# EasyEDA Pro project 搞机小队_v1.1.3.eprj, board 主控
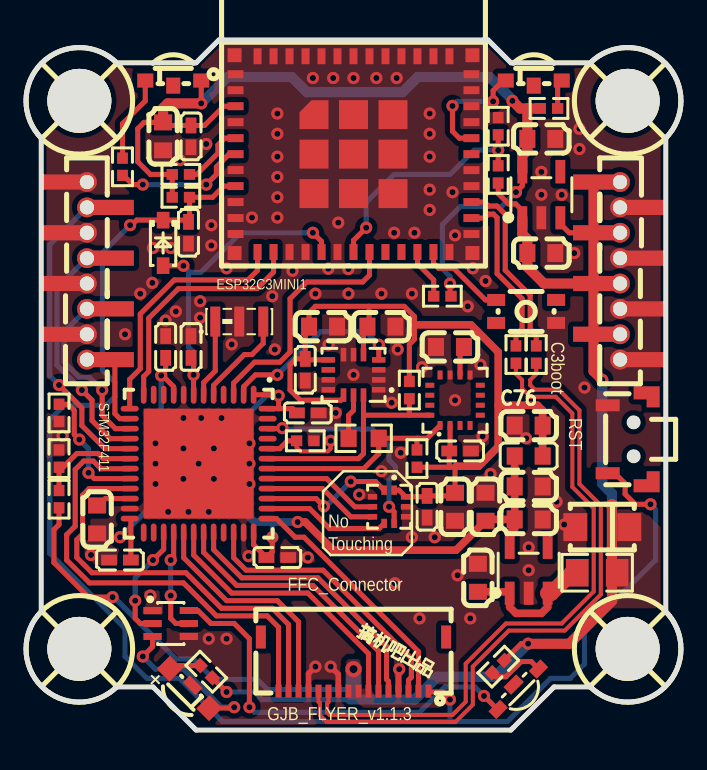
[diagram p2: board, top side]
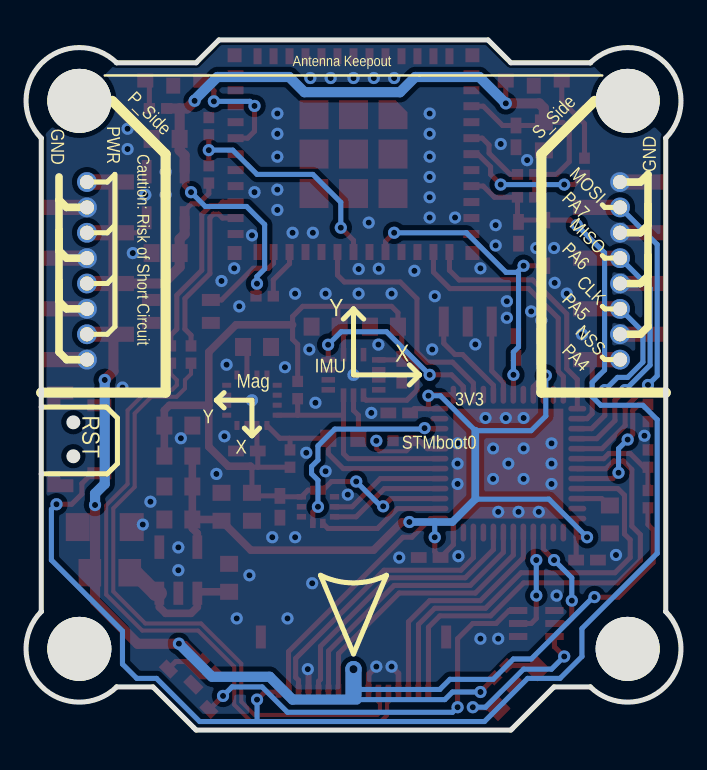
[diagram p3: board, bottom side, seen from below]

Outline 32.77 x 34.54 mm; copper layers: Top Layer, Bottom Layer. Coordinates in mm from the lower left corner of the outline.
Outline path: 4.53,33.41 arc(0.79,33.38) 0.76,29.64 0.77,29.63 0.77,5.93 0.76,5.92 arc(0.79,2.18) 4.53,2.15 4.54,2.16 6.35,2.16 8.51,0 24.26,0 26.42,2.16 28.24,2.16 28.24,2.15 arc(31.99,2.18) 32.01,5.92 32.01,5.93 32.01,29.63 32.01,29.64 arc(31.99,33.38) 28.24,33.41 28.24,33.4 24.26,33.4 23.12,34.54 9.66,34.54 8.51,33.4 4.54,33.4 ; 4.53,33.41 4.54,33.4 ; 4.53,33.41 4.54,33.4
Stack: Top Layer 0.035mm / Dielectric1 1.51mm FR4 er 4.5 / Bottom Layer 0.035mm

## Design rules (mm)
net $1N52615: DP5
net $1N52617: DP5
net UD3_N: DP4
net UD3_P: DP4
template: 自定义配置
spacing copperThickness1oz (default): track to track 0.102, other pairs 0.152 to 0.3
spacing copperThickness2oz: track to track 0.203, other pairs 0.152 to 0.3
track width copperThickness1oz (default): min 0.127, default 0.254, max 2.54
track width copperThickness2oz: min 0.203, default 0.254, max 2.54
differential pair differentialPair (default): width min 0.127, default 0.254, max 2.54; gap min 0.152, default 0.152
via viaSize (default): diameter min 0.5, default 0.61, max 10; hole min 0.3, default 0.305, max 6.3

## Placement (name value [footprint] x y rotation side)
C3  10uF  [C0603]  25.79 23.88 180 top
C4  1uF  [C0603]  25.79 29.59 180 top
C6  1uF  [C0603]  25.15 10.54 180 top
C7  1uF  [C0603]  22.61 7.62 270 top
C8  10uF  [C0603]  25.15 12.19 180 top
C27  10uF  [C0603]  3.56 10.54 90 top
C31  10uF  [C0603]  22.99 11.18 270 top
C41  10uF  [C0603]  6.86 29.72 270 top
C51  4.7uF  [C0603]  21.47 11.18 270 top
C52  4.7uF  [C0603]  21.21 19.18 180 top
C55  2.2uF  [C0603]  14.86 20.19 180 top
C56  10nF  [C0603]  17.78 20.19 180 top
C65  100nF  [C0402]  4.7 8.51 0 top
C66  100nF  [C0402]  12.58 8.64 180 top
C67  100nF  [C0402]  14.1 15.88 180 top
C68  100nF  [C0402]  6.99 19.18 270 top
C69  100nF  [C0402]  8.26 19.18 270 top
C70  100nF  [C0402]  13.97 18.03 90 top
C71  100nF  [C0402]  21.72 13.97 180 top
C72  100nF  [C0402]  20.07 11.18 90 top
C73  100nF  [C0402]  8.13 24.89 90 top
C74  100nF  [C0402]  8.26 29.72 270 top
C75  47uF  [CAP-SMD_L3.2-W1.6]  28.83 10.16 180 top
C76  10uF  [C0603]  25.15 15.24 0 top
D4  BAT54WS  [SOD-323_L1.7-W1.3-LS2.6-RD]  6.86 24.38 270 top
FPC2  AFC05-S16FIA-00  [FPC-SMD_16P-P0.50_AFC05-S16FIA-00]  16.39 3.3 180 top
LED2  XL-3210SURC  [LED-SMD_3P-L3.2-W1.5-RD_EH-S110KGKT]  24.52 2.16 225 top
LED3  XL-3210UWC  [LED-SMD_3P-L3.2-W1.5-RD_ORANGE]  7.37 32.38 0 top
LED4  XL-3210UWC  [LED-SMD_3P-L3.2-W1.5-RD_ORANGE]  25.4 32.38 0 top
NOREF  -  [Pad_e1243]  3.05 24.89 0 top
NOREF#2  -  [Pad_e1242]  3.05 26.16 0 top
NOREF#3  -  [Pad_e1265]  29.72 24.89 0 top
NOREF#4  -  [Pad_e1247]  3.05 19.81 0 top
NOREF#5  -  [Pad_e1246]  3.05 21.08 0 top
NOREF#6  -  [Pad_e1264]  29.72 26.16 0 top
NOREF#7  -  [Pad_e1241]  3.05 27.43 0 top
NOREF#8  -  [Pad_e1267]  29.72 22.35 0 top
NOREF#9  -  [Pad_e1266]  29.72 23.62 0 top
NOREF#10  -  [Pad_e1248]  3.05 18.54 0 top
NOREF#11  -  [Pad_e1269]  29.72 19.81 0 top
NOREF#12  -  [Pad_e1244]  3.05 23.62 0 top
NOREF#13  -  [Pad_e1268]  29.72 21.08 0 top
NOREF#14  -  [Pad_e1270]  29.72 18.54 0 top
NOREF#15  -  [Pad_e1245]  3.05 22.35 0 top
NOREF#16  -  [Pad_e1263]  29.72 27.43 0 top
Q7  BSS138PS  [SOT-363_L2.1-W1.3-P0.65-LS2.3-BL]  7.24 5.33 270 top
R2  0Ω  [R0805]  28.58 7.87 180 top
R51  0Ω  [R0402]  24.52 18.8 90 top
R52  0Ω  [R0402]  25.53 18.8 90 top
R53  10kΩ  [R0402]  7.75 27.81 0 top
R54  10kΩ  [R0402]  20.83 21.72 180 top
R55  10kΩ  [R0402]  7.75 26.67 180 top
R56  10kΩ  [R0402]  1.66 15.88 270 top
R57  10kΩ  [R0402]  13.97 14.48 180 top
R71  10kΩ  [R0402]  1.66 11.56 270 top
R72  10kΩ  [R0402]  1.66 13.59 270 top
R73  10kΩ  [R0402]  23.63 27.81 270 top
R74  10kΩ  [R0402]  23.63 30.23 270 top
R80  4.7kΩ  [R0402]  19.18 17.02 270 top
R81  4.7kΩ  [R0402]  19.56 13.59 90 top
R100  10kΩ  [R0402]  9.02 2.92 315 top
R101  10kΩ  [R0402]  23.63 3.17 45 top
R102  10kΩ  [R0402]  4.83 28.19 90 top
R103  10kΩ  [R0402]  26.17 31.11 180 top
R104  0Ω  [R0603]  16.9 14.6 0 top
SCREW5  -  [M3螺丝]  2.67 31.5 0 top
SCREW6  -  [M3螺丝]  2.67 4.06 0 top
SCREW7  -  [M3螺丝]  30.1 31.5 0 top
SCREW8  -  [M3螺丝]  30.1 4.06 0 top
SW3  TS24CA  [SW-SMD_2P-TS24CA]  30.08 14.55 270 top
SW4  1TS028A-1800-0600-CT  [SW-SMD_4P-L2.8-W1.9-P1.20-LS3.0_1TS028A]  25.02 20.95 0 top
U2  XC6204B302MR  [SOT-23-5_L3.0-W1.7-P0.95-LS2.8-BL]  25.79 26.8 0 top
U3  XC6204B302MR  [SOT-23-5_L3.0-W1.7-P0.95-LS2.8-BL]  25.15 8 0 top
U9  STM32F411CEU6  [UFQFPN-48_L7.0-W7.0-P0.50-BL-EP]  8.64 13.33 180 top
U10  2.4GHz  [WIFIM-SMD_ESP32-C3-MINI-1]  16.39 28.83 0 top
U15  LPS22HBTR  [HLGA-10L_LPS22HBTR]  18.17 11.18 270 top
U16  QMC5883P  [LGA-16_L3.0-W3.0-P0.50-BL_SQ]  21.47 16.51 0 top
U17  ICM-42688-P  [LGA-14_L3.0-W2.5-P0.50-TL]  16.39 17.78 180 top
U20  XL-3210UGC  [LED-SMD_3P-L3.2-W1.5-RD_GREEN]  8.26 2.16 135 top
U21  IPCP127F08PB08S  [HDR-SMD_IPCP127F08PB08S]  3.05 22.99 270 top
U22  IPCP127F08PB08S  [HDR-SMD_IPCP127F08PB08S]  29.72 22.99 90 top
U23  MPH160809S100MT  [L0603]  25.15 13.72 0 top
X2  8MHz  [OSC-SMD_3P-L3.2-W1.3-P1.20]  10.67 20.45 0 top

## Footprints (pads in the part's own frame, mm; a bottom-side part is the same pattern mirrored in y, then rotated)
C0402
  rect 0.79x0.54 smd: 1(-0.545,0) 2(0.545,0)
C0603
  rect 0.8x0.9 smd: 1(-0.7,0) 2(0.7,0)
CAP-SMD_L3.2-W1.6
  rect 1.2x1.4 smd: 1(-1.35,0) 2(1.35,0)
FPC-SMD_16P-P0.50_AFC05-S16FIA-00
  rect 0.3x0.65 smd: 1(-3.75,1.355) 2(-3.25,1.355) 3(-2.75,1.355) 4(-2.25,1.355) 5(-1.75,1.355) 6(-1.25,1.355) 7(-0.75,1.355) 8(-0.25,1.355) 9(0.25,1.355) 10(0.75,1.355) 11(1.25,1.355) 12(1.75,1.355) 13(2.25,1.355) 14(2.75,1.355) 15(3.25,1.355) 16(3.75,1.355)
  rect 0.5x1.15 smd: 17(4.635,-1.355) 18(-4.635,-1.355)
HDR-SMD_IPCP127F08PB08S
  rect 0.76x2.05 smd: 1(-4.445,-1.325) 2(-3.175,1.325) 3(-1.905,-1.325) 4(-0.635,1.325) 5(0.635,-1.325) 6(1.905,1.325) 7(3.175,-1.325) 8(4.445,1.325)
HLGA-10L_LPS22HBTR
  rect 0.465x0.28 smd: 1(-0.833,0.255) 2(-0.833,-0.245) 6(0.833,-0.245) 7(0.833,0.255)
  rect 0.28x0.465 smd: 3(-0.5,-0.828) 4(0,-0.828) 5(0.5,-0.828) 8(0.5,0.828) 9(0,0.828) 10(-0.5,0.828)
L0603
  rect 0.8x0.864 smd: 1(-0.7,0) 2(0.7,0)
LED-SMD_3P-L3.2-W1.5-RD_EH-S110KGKT
  rect 0.82x0.55 smd: 1(1.43,0.165) 2(-1.43,0.165)
  rect 0.9x0.54 smd: 3(0,-0.165)
LED-SMD_3P-L3.2-W1.5-RD_GREEN
  rect 0.9x0.93 smd: 1(-1.4,0.11) 2(1.4,0.11)
  rect 0.9x0.49 smd: 3(0,-0.11)
LED-SMD_3P-L3.2-W1.5-RD_ORANGE
  rect 0.8x0.7 smd: 1(-1.4,0.127) 2(1.4,0.127)
  rect 0.7x0.8 smd: 3(0,-0.127)
LGA-14_L3.0-W2.5-P0.50-TL
  rect 0.675x0.28 smd: 1(-1.262,0.75) 2(-1.262,0.25) 3(-1.262,-0.25) 4(-1.262,-0.75) 8(1.262,-0.75) 9(1.262,-0.25) 10(1.262,0.25) 11(1.262,0.75)
  rect 0.28x0.675 smd: 5(-0.5,-1.012) 6(0,-1.012) 7(0.5,-1.012) 12(0.5,1.012) 13(0,1.012) 14(-0.5,1.012)
LGA-16_L3.0-W3.0-P0.50-BL_SQ
  rect 0.25x0.45 smd: 1(-0.75,-1.263) 2(-0.25,-1.263) 3(0.25,-1.263) 4(0.75,-1.263) 9(0.75,1.263) 10(0.25,1.263) 11(-0.25,1.263) 12(-0.75,1.263)
  rect 0.45x0.25 smd: 5(1.263,-0.75) 6(1.263,-0.25) 7(1.263,0.25) 8(1.263,0.75) 13(-1.263,0.75) 14(-1.263,0.25) 15(-1.263,-0.25) 16(-1.263,-0.75)
M3螺丝
  round 3.2 hole 3.2: 1(0,0)
OSC-SMD_3P-L3.2-W1.3-P1.20
  rect 0.5x1.5 smd: 1(-1.2,0) 2(0,0) 3(1.2,0)
Pad_e1241
  round 0.991 hole 0.711: 1(0,0)
Pad_e1242
  round 0.991 hole 0.711: 2(0,0)
Pad_e1243
  round 0.991 hole 0.711: 3(0,0)
Pad_e1244
  round 0.991 hole 0.711: 4(0,0)
Pad_e1245
  round 0.991 hole 0.711: 5(0,0)
Pad_e1246
  round 0.991 hole 0.711: 6(0,0)
Pad_e1247
  round 0.991 hole 0.711: 7(0,0)
Pad_e1248
  round 0.991 hole 0.711: 8(0,0)
Pad_e1263
  round 0.991 hole 0.711: 1(0,0)
Pad_e1264
  round 0.991 hole 0.711: 2(0,0)
Pad_e1265
  round 0.991 hole 0.711: 3(0,0)
Pad_e1266
  round 0.991 hole 0.711: 4(0,0)
Pad_e1267
  round 0.991 hole 0.711: 5(0,0)
Pad_e1268
  round 0.991 hole 0.711: 6(0,0)
Pad_e1269
  round 0.991 hole 0.711: 7(0,0)
Pad_e1270
  round 0.991 hole 0.711: 8(0,0)
R0402
  rect 0.566x0.54 smd: 1(-0.433,0) 2(0.433,0)
R0603
  rect 0.806x0.864 smd: 1(-0.753,0) 2(0.753,0)
R0805
  rect 1.133x1.377 smd: 1(-1,0) 2(1,0)
SOD-323_L1.7-W1.3-LS2.6-RD
  rect 0.83x0.63 smd: 1(-1.14,0) 2(1.14,0)
SOT-23-5_L3.0-W1.7-P0.95-LS2.8-BL
  rect 0.49x1.157 smd: 1(-0.95,-1.153) 2(0,-1.153) 3(0.95,-1.153)
  rect 0.49x1.175 smd: 4(0.95,1.153) 5(-0.95,1.153)
SOT-363_L2.1-W1.3-P0.65-LS2.3-BL
  rect 0.35x0.916 smd: 1(-0.65,-0.908) 2(0,-0.908) 3(0.65,-0.908) 4(0.65,0.908) 5(0,0.908) 6(-0.65,0.908)
SW-SMD_2P-TS24CA
  rect 0.6x1.2 smd: 1(-1.7,-0.975) 2(1.7,-0.975)
  custom 1.05x1.3 smd: 3(2.125,0.975) 4(-2.125,0.975)
SW-SMD_4P-L2.8-W1.9-P1.20-LS3.0_1TS028A
  rect 0.9x0.6 smd: 1(-1.5,0.575) 2(-1.5,-0.575) 3(1.5,0.575) 4(1.5,-0.575)
UFQFPN-48_L7.0-W7.0-P0.50-BL-EP
  oval 0.28x0.9 smd: 1(-2.751,-3.45) 2(-2.251,-3.45) 3(-1.75,-3.45) 4(-1.25,-3.45) 5(-0.749,-3.45) 6(-0.249,-3.45) 7(0.249,-3.45) 8(0.75,-3.45) 9(1.25,-3.45) 10(1.75,-3.45) 11(2.251,-3.45) 12(2.751,-3.45) 25(2.751,3.449) 26(2.251,3.449) 27(1.75,3.449) 28(1.25,3.449) 29(0.75,3.449) 30(0.249,3.449) 31(-0.249,3.449) 32(-0.749,3.449) 33(-1.25,3.449) 34(-1.75,3.449) 35(-2.251,3.449) 36(-2.751,3.449)
  oval 0.9x0.28 smd: 13(3.45,-2.751) 14(3.45,-2.251) 15(3.45,-1.75) 16(3.45,-1.25) 17(3.45,-0.75) 18(3.45,-0.249) 19(3.45,0.249) 20(3.45,0.749) 21(3.45,1.25) 22(3.45,1.75) 23(3.45,2.251) 24(3.45,2.751) 37(-3.449,2.751) 38(-3.449,2.251) 39(-3.449,1.75) 40(-3.449,1.25) 41(-3.449,0.749) 42(-3.449,0.249) 43(-3.449,-0.249) 44(-3.449,-0.75) 45(-3.449,-1.25) 46(-3.449,-1.75) 47(-3.449,-2.251) 48(-3.449,-2.751)
  rect 5.5x5.5 smd: 49(0,0)
WIFIM-SMD_ESP32-C3-MINI-1
  rect 0.8x0.4 smd: 1(-5.9,4) 2(-5.9,3.2) 3(-5.9,2.4) 4(-5.9,1.6) 5(-5.9,0.8) 6(-5.9,0) 7(-5.9,-0.8) 8(-5.9,-1.6) 9(-5.9,-2.4) 10(-5.9,-3.2) 11(-5.9,-4) 25(5.9,-4) 26(5.9,-3.2) 27(5.9,-2.4) 28(5.9,-1.6) 29(5.9,-0.8) 30(5.9,0) 31(5.9,0.8) 32(5.9,1.6) 33(5.9,2.4) 34(5.9,3.2) 35(5.9,4)
  rect 0.4x0.8 smd: 12(-4.8,-4.9) 13(-4,-4.9) 14(-3.2,-4.9) 15(-2.4,-4.9) 16(-1.6,-4.9) 17(-0.8,-4.9) 18(0,-4.9) 19(0.8,-4.9) 20(1.6,-4.9) 21(2.4,-4.9) 22(3.2,-4.9) 23(4,-4.9) 24(4.8,-4.9) 36(4.8,4.9) 37(4,4.9) 38(3.2,4.9) 39(2.4,4.9) 40(1.6,4.9) 41(0.8,4.9) 42(0,4.9) 43(-0.8,4.9) 44(-1.6,4.9) 45(-2.4,4.9) 46(-3.2,4.9) 47(-4,4.9) 48(-4.8,4.9)
  custom 1.45x1.45 smd: 49(-1.975,1.975)
  rect 1.45x1.45 smd: 49(-1.975,0) 49(-1.975,-1.975) 49(0,1.975) 49(0,0) 49(0,-1.975) 49(1.975,1.975) 49(1.975,0) 49(1.975,-1.975)
  rect 0.7x0.7 smd: 50(5.95,4.95) 51(5.95,-4.95) 52(-5.95,-4.95) 53(-5.95,4.95)

## Nets
As in the schematic, except:
GND: C3.1 C4.1 C6.1 C7.1 C8.1 C27.1 C31.1 C41.2 C51.2 C52.2 C55.1 C56.1 C65.1 C66.1 C67.1 C68.1 C69.1 C70.1 C71.1 C72.1 C73.1 C74.2 C75.2 C76.1 FPC2.4 FPC2.10 FPC2.13 NOREF.3 NOREF#4.7 NOREF#6.2 NOREF#7.1 NOREF#9.4 NOREF#13.6 NOREF#14.8 NOREF#15.5 Q7.1 Q7.4 R56.2 R57.1 R72.1 R74.1 SW3.1 SW4.4 U2.2 U3.2 U9.8 U9.23 U9.35 U9.47 U9.49 U10.1 U10.2 U10.4 U10.7 U10.9 U10.10 U10.11 U10.14 U10.15 U10.17 U10.24 U10.25 U10.28 U10.29 U10.32 U10.33 U10.34 U10.35 U10.36 U10.37 U10.38 U10.39 U10.40 U10.41 U10.42 U10.43 U10.44 U10.45 U10.46 U10.47 U10.48 U10.49 U10.50 U10.51 U10.52 U10.53 U15.3 U15.8 U15.9 U16.9 U16.11 U17.1 U17.2 U17.3 U17.6 U17.7 U17.10 U17.11 U21.1 U21.3 U21.5 U21.7 U22.1 U22.3 U22.5 U22.7 X2.2
POWER: C3.2 C75.1 FPC2.8 FPC2.9 NOREF#3.3 NOREF#8.5 NOREF#11.7 NOREF#16.1 R2.1 R71.2 R73.2 R100.2 R101.2 U2.1 U2.3 U22.2 U22.4 U22.6 U22.8
STM_SPI_CLK1: NOREF#5.6 U9.15 U21.6
STM_SPI_MISO1: NOREF#12.4 U9.16 U21.4
STM_SPI_MOSI1: NOREF#2.2 U9.17 U21.2
STM_SPI_NSS1: NOREF#10.8 U9.14 U21.8

Pads without a net: FPC2 17 18; LED2 3; LED3 3; LED4 3; SCREW5 1; SCREW6 1; SCREW7 1; SCREW8 1; SW3 3 4; SW4 2 3; U2 4; U3 4; U9 4 10 11 25 26 33 45; U10 20 21 30; U16 3 4 5 6 7 8 12 13 14 15; U17 9; U20 3

## Via types
v1: diameter 0.61, hole 0.305, Top Layer to Bottom Layer, 153 vias
v2: diameter 0.813, hole 0.406, Top Layer to Bottom Layer, 1 via

## Routing (per net, layer and track width the routed paths; a pad name or vN(x,y) marks a point on that pad's centre or on a via; arc(x,y) is an arc through that point)
3V3_D: length 51.1
  Top Layer w0.254: C67.2 13.35,16.09 12.64,16.09 ; 12.64,16.09 v1(12.64,16.73) 12.59,16.78 U9.1 ; 12.64,16.09 U9.48 ; U9.36 11.39,9.28 C66.2 12.32,8.93 v1(12.32,9.65) ; U9.24 5.25,10.53 5.25,9.65 ; U9.9 7.39,17.19 6.8,17.78 v1(6.77,17.75) 6.74,17.78 6.99,18.03 C68.2 ; 5.25,9.65 C65.2 ; 5.25,9.65 v1(4.7,9.65)
  Top Layer w0.381: U3.5 24.2,9.84 24.45,10.09 C6.2 ; C6.2 C8.2 U23.1 ; C6.2 23.06,10.54 C31.2 21.52,9 15.38,9 13.97,10.41 v1(13.59,10.41)
  Bottom Layer w0.254: 10.29,11.56 6.61,11.56 v1(4.7,9.65) ; v1(6.77,17.75) 6.77,15.72 7.5,14.99 10.29,14.99 12.04,16.73 v1(12.64,16.73) ; v1(12.32,9.65) 12.32,10.41
  Bottom Layer w0.381: 10.29,14.99 10.29,11.56 11.43,10.41 v1(13.59,10.41)
3V3_IMU: length 45.5
  Top Layer w0.254: U17.12 15.89,16.64 15.75,16.51 13.72,16.51 13.21,17.02 13.21,18.29 13.5,18.58 C70.2 ; 21.17,13.16 21.18,13.16 C71.2 21.22,14.01 U16.2 ; 21.17,13.16 R81.1 ; 21.17,13.16 21.49,13.16 ; U15.1 18.66,12.01 U15.10 20.03,11.68 C72.2 21.31,11.72 C51.1 21.47,13.14 ; 17.17,21.21 17.17,20.27 C56.2 16.89,20 U17.5 ; 17.17,21.21 14.48,21.21 14.16,20.89 14.16,20.19 13.97,20 C70.2 ; 17.17,21.21 18.93,21.21 19.44,20.7 19.44,19.56 19.18,19.3 R80.1 ; C70.2 14.02,18.53 U17.8
  Top Layer w0.381: 19.44,20.28 22.27,20.28 23.63,18.92 23.63,16.26 ; 23.63,16.26 25.6,16.26 25.85,16 U23.2 ; 23.63,16.26 23.63,14.18 22.65,13.21 21.54,13.21 21.49,13.16
3V3_RF: length 45.5
  Top Layer w0.254: v1(24.52,26.92) 24.84,27.24 24.84,27.95 ; U10.3 9.9,31.23 8.93,30.26 C74.1 7.02,30.26 C41.1 5.91,30.42 5.59,30.1 5.59,28.45 6.23,27.81 R53.1 R55.2 ; v1(8.77,31.37) 8.77,31.37 8.77,32.51 ; 21.22,21.71 v1(21.22,22.34)
  Top Layer w0.508: 25.09,31.11 24.72,31.11 v1(24.34,31.5) ; 25.09,31.11 C4.2 25.09,29.02 24.84,28.77 24.84,27.95 ; 25.09,31.11 R103.2 ; v1(8.77,31.37) 7.09,31.37 6.86,31.14 C41.1
  Bottom Layer w0.254: v1(21.22,22.34) 21.22,22.7 20.83,23.09 20.83,25.3 21.74,26.21 23.8,26.21 v1(24.52,26.92)
  Bottom Layer w0.508: v1(24.34,31.5) 24.34,31.55 23.19,32.69 19.6,32.69 18.84,31.93 14.06,31.93 13.3,32.69 10.09,32.69 v1(8.77,31.37)
GND: length 3.9
  Top Layer w0.28: FPC2.13 14.14,2.83 v1(14.48,3.17) ; v1(15.24,3.17) 15.63,2.79 15.63,1.96 FPC2.10
  Top Layer w0.305: FPC2.4 18.64,3.01 v1(18.67,3.05)
  vias: v1(1.83,14.73) v1(3.26,8.76) v1(4.96,19.81) v1(5.72,21.84) v1(6.23,6.73) v1(6.35,24.13) v1(6.32,22.38) v1(6.48,14.35) v1(6.48,13.33) v1(6.48,12.32) v1(6.99,20.5) v1(7.12,10.92) v1(7.24,24.13) v1(7.5,20.95) v1(7.7,28.53) v1(7.88,15.62) v1(7.88,14.1) v1(7.88,12.57) v1(8.13,10.92) v1(8.72,21.46) v1(8.72,20.64) v1(8.64,13.33) v1(8.77,15.62) v1(9.02,29.34) v1(9.15,10.92) v1(9.15,4.57) v1(9.28,25.27) v1(9.28,24.26) v1(9.4,14.1) v1(9.4,12.57) v1(9.78,15.62) v1(10.04,23.11) v1(10.04,4.57) v1(10.29,19.3) v1(11.18,14.35) v1(11.18,13.33) v1(11.18,12.32) v1(11.14,8.7) v1(11.31,25.65) v1(12.32,21.72) v1(12.45,19.05) v1(12.58,30.86) v1(12.58,29.84) v1(12.58,28.7) v1(12.58,27.69) v1(12.58,26.67) v1(12.58,25.65) v1(13.34,22.99) v1(14.1,8.64) v1(14.36,32.64) v1(14.48,21.84) v1(15.12,23.09) v1(15.14,19.29) v1(15.37,32.64) v1(15.5,15.88) v1(15.63,25.4) v1(16.13,23.08) v1(16.13,21.84) v1(16.39,32.64) v1(16.39,17.78) v1(16.67,11.78) v1(17.53,32.64) v1(17.78,21.84) v1(17.78,12.95) v1(18.29,16.38) v1(18.42,24.89) v1(18.45,7.35) v1(18.55,32.64) v1(18.6,19.05) v1(18.75,13.88) v1(19.31,21.84) v1(19.31,9.65) v1(19.44,24.89) v1(19.69,5.59) v1(19.82,18.16) v1(20.2,30.86) v1(20.2,29.84) v1(20.2,28.7) v1(20.2,27.05) v1(20.2,26.03) v1(20.45,9.65) v1(21.34,26.92) v1(21.47,24.77) v1(21.47,16.51) v1(21.59,7.75) v1(22.1,21.21) v1(22.23,5.59) v1(22.36,23.11) v1(22.74,18.29) v1(22.85,14.7) v1(22.99,22.48) v1(23.25,12.82) v1(25.02,14.6) v1(25.15,9.14) v1(25.15,8) v1(25.79,27.94) v1(25.79,26.8) v1(26.55,11.43) v1(26.8,26.79) v1(26.93,10.29) v1(27.43,23.88) v1(27.69,30.1) v1(27.69,29.08) v1(27.94,17.14)
BARO_INT: length 10.7
  Top Layer w0.254: v1(18.17,11.18) 18.42,10.92 U15.7 ; U9.46 12.8,15.08 v1(12.83,15.11)
  Bottom Layer w0.254: v1(18.17,11.18) 18.17,12.51 18.49,12.83 18.49,13.19 18.17,13.51 18.17,14.22 17.33,15.06 12.88,15.06 v1(12.83,15.11)
BOOT_IO9: length 4.5
  Top Layer w0.254: SW4.1 22.99,21.53 21.4,23.11 20.64,23.11 20.39,23.37 U10.23
ESP_INT: length 12.3
  Top Layer w0.254: 17.19,23.93 17.19,22.77 16.84,22.43 14.05,22.43 13.21,21.59 13.21,18.92 12.7,18.41 11.43,18.41 10.39,17.37 U9.3
ESP_V_SENSE: length 12
  Top Layer w0.254: v1(17.02,25.15) 16.39,24.51 U10.18 ; 23.63,28.25 v1(23.63,29.03) R74.2
  Bottom Layer w0.254: v1(23.63,29.03) 22.43,29.03 21.21,27.81 18.42,27.81 17.02,26.42 v1(17.02,25.15)
IMU_INT1: length 9.3
  Top Layer w0.254: v1(12.58,17.78) 11.48,17.78 10.89,17.19 U9.2 ; v1(17.66,19.29) 17.65,19.28 U17.4
  Bottom Layer w0.254: v1(17.66,19.29) 17,19.94 14.74,19.94 v1(12.58,17.78)
LED_G: length 8.1
  Top Layer w0.254: 9.18,1.1 10.38,1.1 v1(10.42,1.14) ; v1(5.85,3.68) 6.34,4.17 6.34,4.68
  Bottom Layer w0.254: v1(5.85,3.68) 6.48,3.05 7.88,3.05 9.78,1.14 v1(10.42,1.14)
LED_G#: length 5.4
  Top Layer w0.254: U9.28 7.39,8.66 v1(7.24,8.51) ; 8.14,5.33 7.5,5.33 7.24,5.59 v1(7.24,6.73)
  Bottom Layer w0.254: v1(7.24,8.51) v1(7.24,6.73)
LED_R: length 20.6
  Top Layer w0.254: LED2.1 23.59,1.03 v1(22.92,1.71) ; v1(11.18,1.14) 11.18,4.57 10.42,5.33 9.25,5.33 8.6,5.98 8.14,5.98
  Bottom Layer w0.254: v1(22.92,1.71) 22.46,2.16 20.96,2.16 19.69,0.89 11.43,0.89 v1(11.18,1.14)
LED_R#: length 5.9
  Top Layer w0.254: U9.27 6.89,9.05 v1(6.35,8.51) ; v1(5.47,6.48) 5.47,5.59 5.72,5.33 6.34,5.33
  Bottom Layer w0.254: v1(6.35,8.51) 5.47,7.62 v1(5.47,6.48)
LED_WL: length 6.7
  Top Layer w0.254: v1(5.85,27.3) 5.34,27.3 4.88,27.76 R102.1 ; v1(9.02,27.3) 9.53,27.81 9.53,28.19 10.16,28.83 U10.6
  Bottom Layer w0.254: v1(9.02,27.3) v1(5.85,27.3)
LED_WR: length 5.9
  Top Layer w0.254: v1(23.37,31.47) 23.37,32.01 24,32.64 ; v1(21.34,31.24) 21.34,29.97 21.68,29.63 22.29,29.63
  Bottom Layer w0.254: v1(23.37,31.47) 21.57,31.47 v1(21.34,31.24)
MOTOR1: length 11.8
  Top Layer w0.254: U9.29 7.89,8.62 10.04,6.48 12.58,6.48 13.64,5.42 FPC2.14
MOTOR2: length 21.1
  Top Layer w0.254: FPC2.15 13.14,5.28 12.32,6.1 9.78,6.1 8.01,7.87 3.31,7.87 2.54,8.64 2.54,9.52 2.83,9.81 2.83,11.76 3.16,12.09 U9.21
MOTOR3: length 23
  Top Layer w0.254: U9.19 5.19,13.08 3.75,13.08 3.37,13.46 2.89,13.46 2.46,13.04 2.46,10.21 2.04,9.78 2.04,8.51 3.18,7.37 7.88,7.37 9.53,5.71 12.07,5.71 12.64,5.15 FPC2.16
MOTOR4: length 13.8
  Top Layer w0.254: U9.32 9.39,9.03 10.8,7.62 14.61,7.62 18.04,4.19 18.04,2.54 18.14,2.44 FPC2.5
NRST: length 74
  Top Layer w0.254: v1(5.21,25.27) 5.29,25.27 5.54,25.53 8.04,25.53 C73.2 8.18,25.49 R55.1 9.34,26.67 9.9,27.23 U10.8 ; v1(31.25,11.3) 30.48,11.3 29.98,11.81 29.98,12.34 29.46,12.85 SW3.2 ; FPC2.1 20.18,1.91 20.83,1.91 v1(21.21,1.52)
  Bottom Layer w0.254: v1(31.25,11.3) 31.5,11.05 31.5,8.51 27.94,4.95 27.94,3.3 27.23,2.59 26.24,2.59 24.08,0.43 21.21,0.43 ; v1(21.21,1.52) 21.21,0.43 ; 21.21,0.43 9.83,0.43 7.67,2.59 6.05,2.59 4.96,3.68 4.96,5.08 1.19,8.84 1.19,15.54 1.91,16.26 4.02,16.26 4.45,16.69 4.45,17.4 3.83,18.02 3.83,23.89 v1(5.21,25.27)
POWER: length 77.8
  Top Layer w0.254: U22.6 27.18,24.89 26.74,25.34 U2.3 ; R73.2 23.63,26.85 24.14,26.34 24.5,26.34 24.84,26 24.84,25.64 ; R71.2 1.66,10.29 1.4,10.03 1.4,8.38 3.13,6.66 v1(4.33,6.66) ; v1(25.12,4.32) 24.78,4.32 R101.2 ; 9.33,2.61 v1(10.04,1.91)
  Top Layer w0.508: U22.4 U22.6 U22.8 ; U22.4 25.91,22.35 25.09,23.18 C3.2 25.09,24.58 24.84,24.83 24.84,25.64 ; U22.4 U22.2 28.4,17.96 v1(28.83,17.53) ; v1(29.32,11.26) 29.32,6.45 27.18,4.32 25.13,4.32 v1(25.12,4.32)
  Bottom Layer w0.254: 16.23,1.52 11.82,1.52 11.43,1.91 v1(10.04,1.91) ; v1(4.33,6.66) 4.4,6.66 7.5,3.56 8.39,3.56 9.4,2.54 11.56,2.54 12.07,2.03 16.23,2.03
  Bottom Layer w0.508: v1(28.83,17.53) 28.83,12.32 29.32,11.83 v1(29.32,11.26) ; 16.23,1.52 19.44,1.52 20.58,2.67 23.47,2.67 v1(25.12,4.32)
  Bottom Layer w0.813: v2(16.39,3.05) 16.39,1.78
STM_BOOT0: length 4.2
  Top Layer w0.203: R57.2 13.54,14.15 13.74,13.95 15.1,13.95 15.24,14.1 v1(15.24,14.48)
  Top Layer w0.254: R57.2 13.09,14.48 12.69,14.08 U9.44
STM_NRST: length 16.9
  Top Layer w0.254: U9.7 8.39,16.79 v1(8.39,17.78) 8.39,18.5 C69.2 ; 6.74,23.24 6.74,23.24 v1(7.88,23.24) ; v1(14.36,24.89) 14.79,24.46 14.79,23.93
  Bottom Layer w0.254: v1(14.36,24.89) 10.74,24.89 8.76,22.91 8.21,22.91 ; 8.21,22.91 8.13,22.83 8.13,19.18 8.39,18.92 v1(8.39,17.78) ; 8.21,22.91 v1(7.88,23.24)
STM_RXD1: length 13.8
  Top Layer w0.254: U9.31 8.89,8.89 10.55,7.24 14.36,7.24 17.64,3.96 FPC2.6 17.66,1.97
STM_RXD2: length 12.6
  Top Layer w0.254: U9.13 5.19,17.56 5.72,18.08 5.72,20.83 7.42,22.53 11.1,22.53 11.59,23.01 U10.12
STM_SPI_CLK1: length 8.5
  Top Layer w0.254: v1(3.81,17.02) 3.81,15.75 4.48,15.08 U9.15
  Bottom Layer w0.254: v1(3.81,17.02) 3.18,17.65 2.67,17.65 1.91,18.41 1.91,19.94 NOREF#5.6
STM_SPI_CLK3: length 6.7
  Top Layer w0.254: v1(16.25,12.44) 17.49,12.44 U15.2 ; U9.39 14.52,11.58 v1(14.9,11.2)
  Bottom Layer w0.254: v1(14.9,11.2) 15.01,11.2 v1(16.25,12.44)
STM_SPI_MISO1: length 11.7
  Top Layer w0.254: U9.16 4.22,14.58 3.31,15.49 3.31,16.51 v1(2.8,17.02)
  Bottom Layer w0.254: v1(2.8,17.02) 1.55,18.27 1.55,22.12 NOREF#12.4
STM_SPI_MISO3: length 5.8
  Top Layer w0.254: U15.5 16.25,10.68 14.84,12.09 U9.40
STM_SPI_MOSI1: length 15.2
  Top Layer w0.254: v1(1.66,17.27) 2.8,16.13 2.8,15.24 3.95,14.08 U9.17
  Bottom Layer w0.254: v1(1.66,17.27) 1.19,17.73 1.19,24.3 NOREF#2.2
STM_SPI_MOSI3: length 5.8
  Top Layer w0.254: U9.41 15.05,12.59 16.45,11.18 U15.4
STM_SPI_NSS1: length 3.6
  Top Layer w0.254: U9.14 4.7,15.59 4.45,15.84 4.45,18.47 U21.8
STM_SPI_NSS3: length 6.3
  Top Layer w0.254: U9.38 14.19,11.08 15.19,10.09 17.67,10.09 U15.6
STM_SWCLK: length 12.3
  Top Layer w0.254: U9.37 12.53,10.58 13.47,9.65 13.91,9.65 19.64,3.93 FPC2.2
STM_SWDIO: length 13.9
  Top Layer w0.254: FPC2.3 19.14,2.5 19.28,2.64 19.28,3.58 14.86,8 11.02,8 10.39,8.63 U9.34
STM_TXD1: length 13.8
  Top Layer w0.254: FPC2.7 17.14,3.82 14.1,6.86 10.29,6.86 8.39,8.76 U9.30
STM_TXD2: length 12.1
  Top Layer w0.254: U9.12 5.89,17.7 6.14,17.95 6.14,20.62 7.62,22.1 11.56,22.1 12.39,22.92 U10.13
STM_V_SENSE: length 5.1
  Top Layer w0.254: 1.66,11.99 R72.2 1.86,13.16 2.54,13.84 3.61,13.84 3.87,13.58 U9.18
STMI2C_SCL1: length 10.6
  Top Layer w0.254: 19.59,14.6 19.56,14.57 19.56,14.02 ; 19.59,14.6 20.08,14.6 U16.1 ; 19.59,14.6 R104.2 17.65,13.83 16.9,13.09 U9.42
STMI2C_SDA1: length 12
  Top Layer w0.254: 16.89,15.78 U17.14 ; 16.89,15.78 16.89,13.83 16.64,13.58 U9.43 ; 16.89,15.78 16.91,15.76 19.18,15.76 ; 19.18,15.76 R80.2 ; 19.18,15.76 U16.16
UD3_N: length 31.9
  Top Layer w0.203: FPC2.11 15.14,1.42 15.07,1.35 15.07,0.89 15.2,0.76 21.34,0.76 22,1.42 22,3.32 24.01,5.33 26.8,5.33 28.4,6.94 28.4,11.1 27.33,12.17 27.33,15.85 26.5,16.68 25.24,16.68 24.82,17.1 24.82,17.52 24.52,17.83 R51.1
UD3_P: length 33.1
  Top Layer w0.203: R52.1 25.53,17.83 25.23,17.52 25.23,17.27 25.46,17.04 26.66,17.04 27.69,16 27.69,12.31 28.76,11.24 28.76,6.78 26.95,4.98 24.16,4.98 22.36,3.17 22.36,1.27 21.49,0.4 15.05,0.4 14.71,0.74 14.71,1.35 14.64,1.42 FPC2.12
$1N7736: length 7.1
  Top Layer w0.381: 22.61,6.92 24.13,6.92 U3.1 24.2,6.16 24.52,5.84 25.79,5.84 26.1,6.16 U3.3
  Top Layer w0.762: R2.2 27.31,7.87 26.28,6.85 U3.3
$1N7770: length 1.8
  Top Layer w0.254: C27.2 3.63,11.24 3.97,11.58 U9.22
$1N7798: length 4.9
  Top Layer w0.254: X2.3 11.87,19.36 11.31,18.8 10.93,18.8 9.39,17.26 U9.5
$1N7799: length 3.9
  Top Layer w0.254: U9.6 8.89,17.39 9.47,17.98 X2.1
$1N7801: length 6.5
  Top Layer w0.254: U9.20 3.42,12.59 v1(3.13,12.88) ; v1(2.67,14.54) 2.42,14.8 2.42,16 2.11,16.31 R56.1
  Bottom Layer w0.254: v1(3.13,12.88) 3.13,14.08 v1(2.67,14.54)
$1N11574: length 3.3
  Top Layer w0.254: U10.5 9.95,29.63 9.61,29.29 9.61,28.88 8.54,27.81 R53.2
$1N11654: length 2.5
  Top Layer w0.254: U10.22 19.59,23.34 20.4,22.53 R54.2
$1N15598: length 1.5
  Top Layer w0.254: U16.10 21.72,18.98 C52.1
$1N42229: length 2.3
  Top Layer w0.254: U17.13 16.39,16 16.14,15.76 R104.1
$1N52615: length 8.5
  Top Layer w0.254: 22.29,25.63 22.94,25.63 23.14,25.83 23.39,25.83 23.57,25.65 23.57,22.85 24.82,21.6 24.82,20.07 24.52,19.77 R51.2
$1N52617: length 9.2
  Top Layer w0.254: 22.29,26.43 22.94,26.43 23.14,26.23 23.56,26.23 23.98,25.81 23.98,23.02 25.23,21.77 25.23,20.07 25.53,19.77 R52.2
$1N93489: length 1.6
  Top Layer w0.254: 7.2,3.08 7.35,3.23 R100.1
$1N93528: length 2.9
  Top Layer w0.254: R101.1 23.52,2.67 24.01,2.67 24.78,3.43 25.28,3.43 25.64,3.06 LED2.2
$1N93606: length 1.4
  Top Layer w0.254: 26.8,32.51 26.6,32.31 26.6,31.24
$1N93656: length 4.4
  Top Layer w0.254: 5.97,32.51 5.97,31.49 4.83,30.35 R102.2

## Copper pours and planes (outline as drawn; the poured copper is in the pictures)
GND on Top Layer: 8.51,0 6.35,2.16 4.53,2.16 0.76,5.92 0.77,5.93 0.77,29.63 4.54,33.4 8.51,33.4 9.66,34.54 23.12,34.54 24.26,33.4 28.24,33.4 28.24,33.39 32.01,29.62 32.01,5.92 28.24,2.15 28.24,2.16 26.42,2.16 24.26,0
GND on Bottom Layer: 26.42,2.16 24.26,0 8.51,0 6.35,2.16 4.53,2.16 0.76,5.92 0.77,5.93 0.77,29.63 4.54,33.4 8.51,33.4 9.66,34.54 23.12,34.54 24.26,33.4 28.24,33.4 28.24,33.39 32.01,29.62 32.01,5.92 28.24,2.15 28.24,2.16
POWER on Top Layer: 30.87,11.05 32.01,9.91 32.01,6.6 31.5,6.1 29.21,6.1 28.96,6.35 28.96,10.8 29.21,11.05
POWER on Top Layer: 16.74,1.52 16.74,3.46 16.64,3.56 16.13,3.56 16.01,3.43 16.01,1.52

## Text on the board
Bottom Silkscreen Layer: Antenna Keepout | Caution: Risk of Short Circuit | 3V3 | STMboot0 | MOSI / PA7 | MISO / PA6 | CLK / PA5 | NSS / PA4 | PWR | GND | S_Side | P_Side | IMU | Mag | X | Y | RST
Top Silkscreen Layer: ESP32C3MINI1 | STM32F411 | GJB_FLYER_v1.1.3 | FFC_Connector | No / Touching | C3boot | RST | 搞机吧出品
